# EAGLE design Endonasal_Module_Breakout_rev1 (EAGLE 9.0.1)
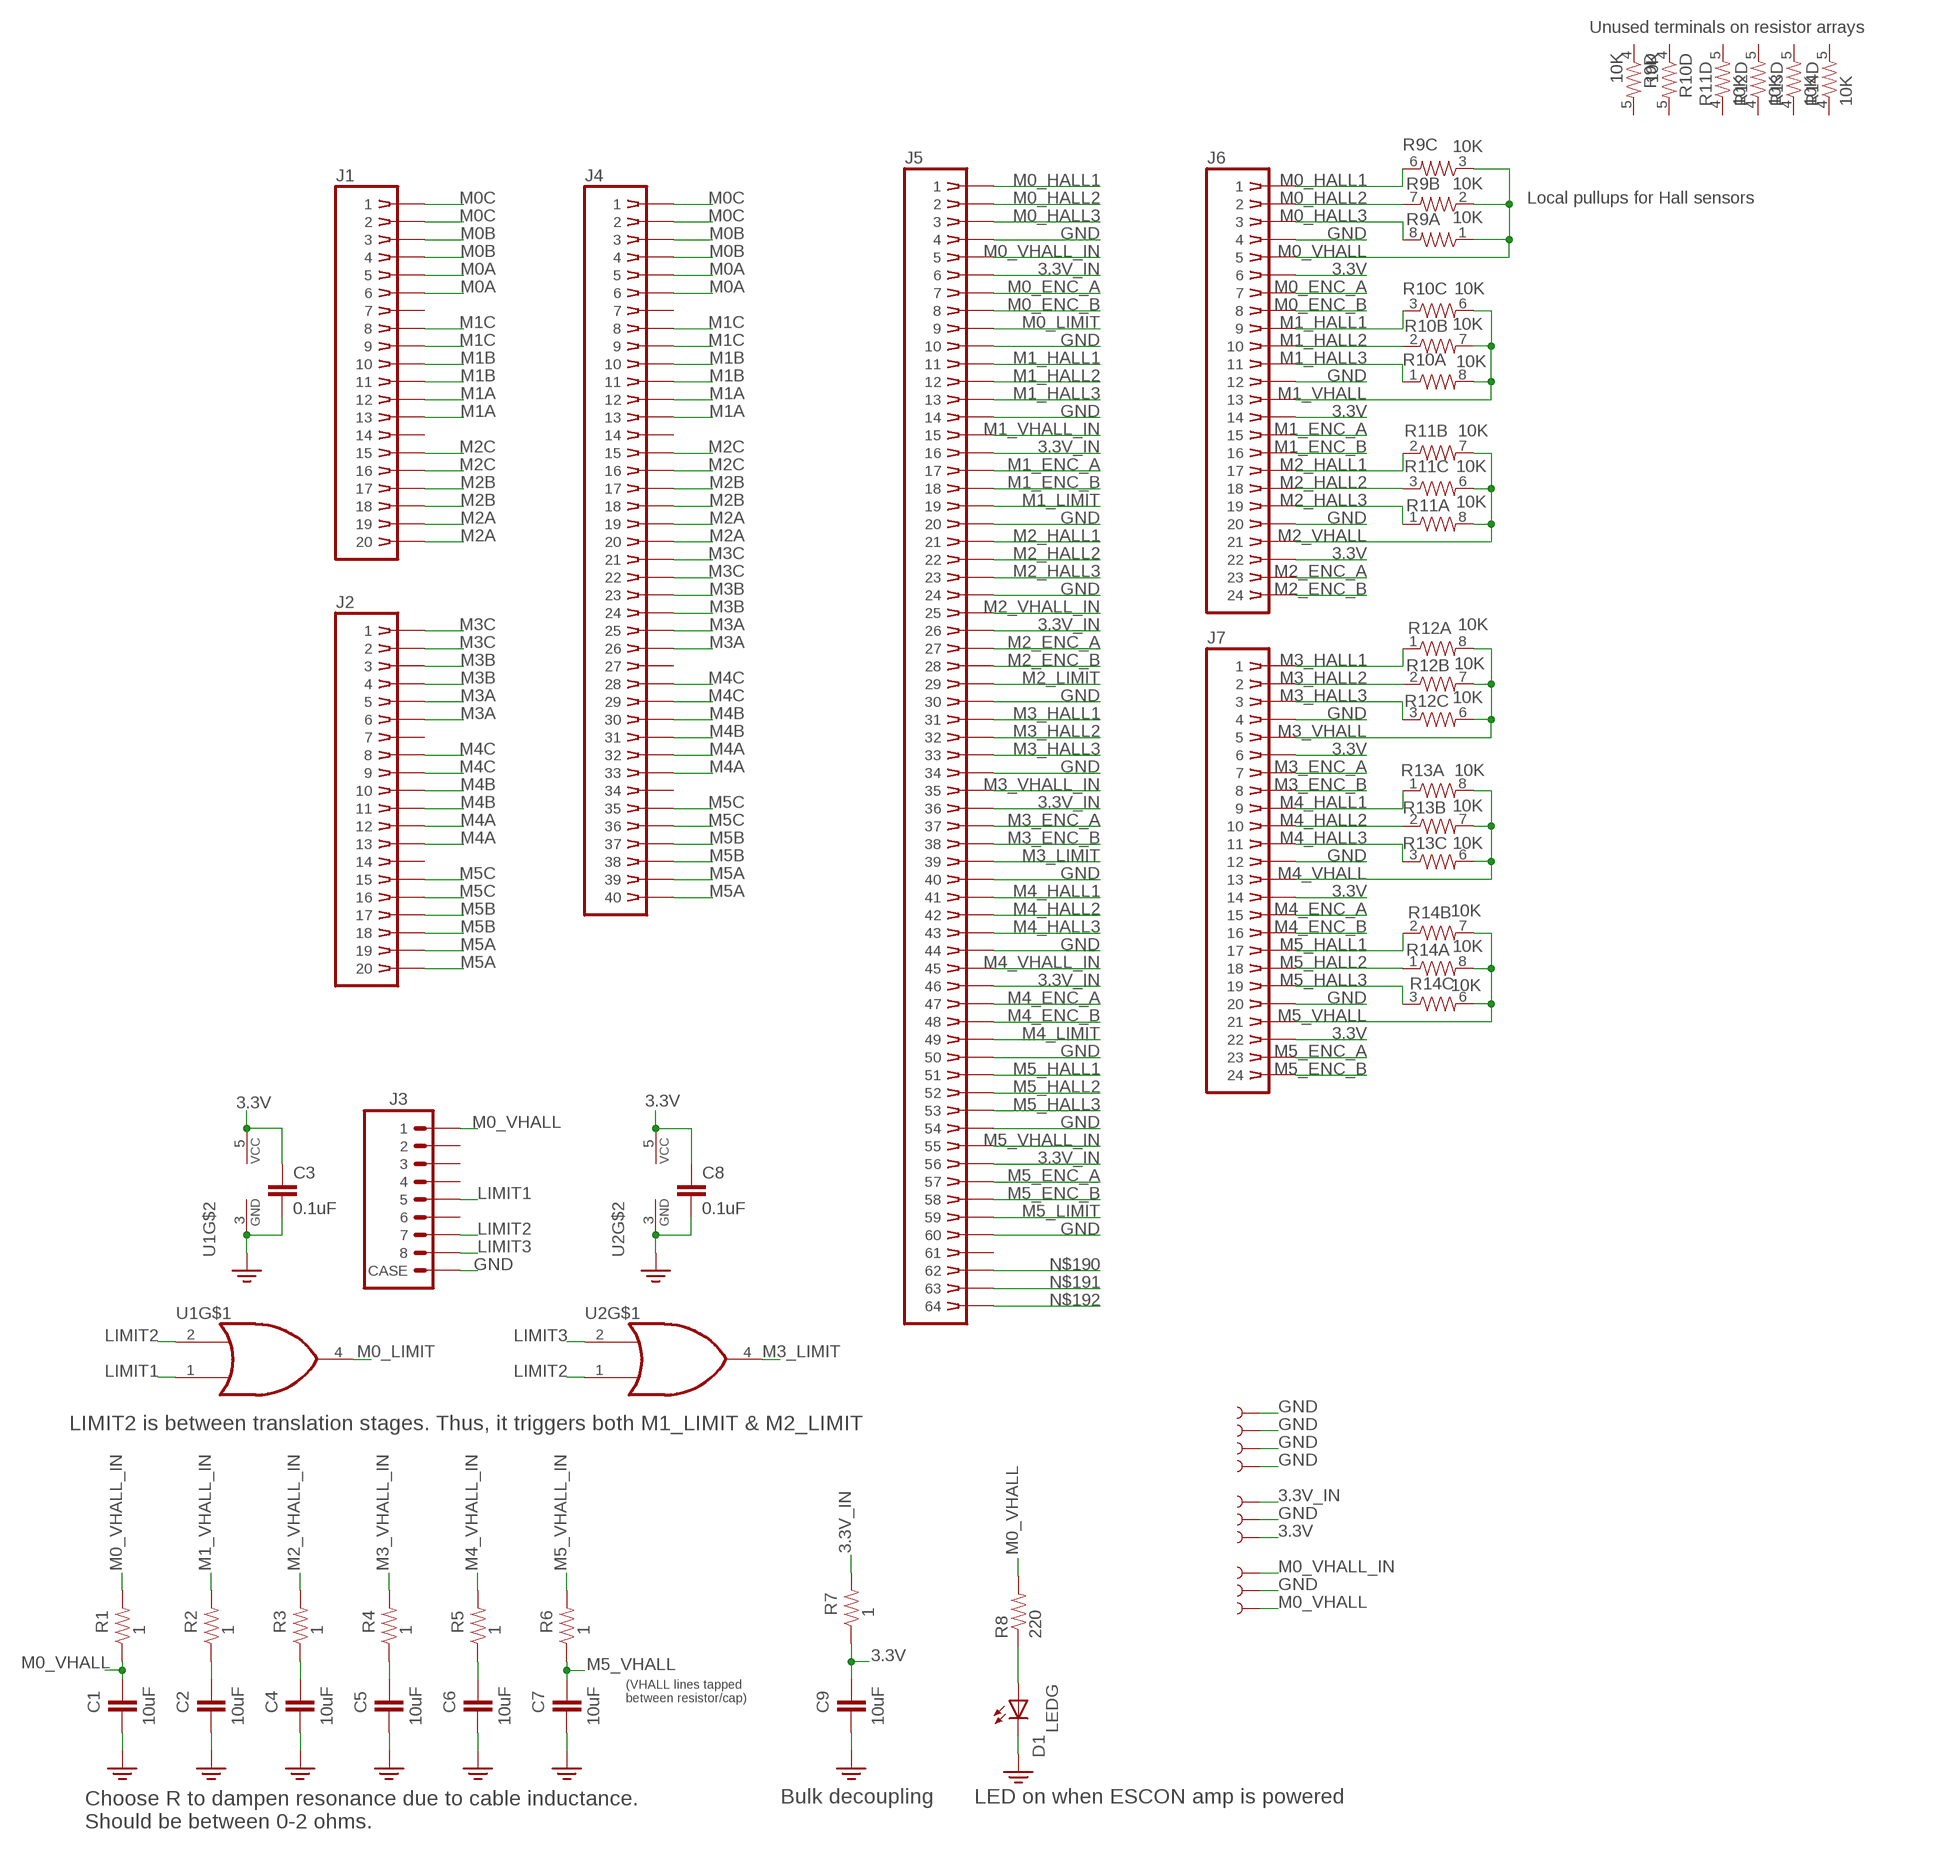
[diagram p0: schematic, sheet 1]

## Parts
3.3V  TEST-POINT_5021  [TEST-POINT_5021]
3.3V-IN  TEST-POINT_5021  [TEST-POINT_5021]
5V  TEST-POINT_5021  [TEST-POINT_5021]
5V-IN  TEST-POINT_5021  [TEST-POINT_5021]
C1  10uF  CAP0805  [C0805K]
C2  10uF  CAP0805  [C0805K]
C3  0.1uF  CAP0603-CAP  [0603-CAP]
C4  10uF  CAP0805  [C0805K]
C5  10uF  CAP0805  [C0805K]
C6  10uF  CAP0805  [C0805K]
C7  10uF  CAP0805  [C0805K]
C8  0.1uF  CAP0603-CAP  [0603-CAP]
C9  10uF  CAP0805  [C0805K]
D1  LEDG  LED-0805  [LED-0805]
GND  TEST-POINT_5021  [TEST-POINT_5021]
J1  CONN_RECT_2X10TH  [CONN_IDC_20_MALE_TH]
J2  CONN_RECT_2X10TH  [CONN_IDC_20_MALE_TH]
J3  JACK_8P8C_RJ45_ETHERNET  [ETHERNET_A104932]
J4  CONN_RECT_2X20TH  [CONN_IDC_40_MALE_TH]
J5  CONN_RECT_2X32NOHOLES  [CONN_IDC_64_MALE_TH_NOHOLES]
J6  CONN_RECT_2X12TH  [CONN_IDC_24_MALE_TH]
J7  CONN_RECT_2X12TH  [CONN_IDC_24_MALE_TH]
R1  1  RESISTOR-0603  [0603-RES]
R2  1  RESISTOR-0603  [0603-RES]
R3  1  RESISTOR-0603  [0603-RES]
R4  1  RESISTOR-0603  [0603-RES]
R5  1  RESISTOR-0603  [0603-RES]
R6  1  RESISTOR-0603  [0603-RES]
R7  1  RESISTOR-0603  [0603-RES]
R8  220  RESISTOR-0603  [0603-RES]
R9  10K  RESISTOR-ARRAY0603-ARV  [0603-ARV]
R10  10K  RESISTOR-ARRAY0603-ARV  [0603-ARV]
R11  10K  RESISTOR-ARRAY0603-ARV  [0603-ARV]
R12  10K  RESISTOR-ARRAY0603-ARV  [0603-ARV]
R13  10K  RESISTOR-ARRAY0603-ARV  [0603-ARV]
R14  10K  RESISTOR-ARRAY0603-ARV  [0603-ARV]
TP5  TEST-POINT_5021  [TEST-POINT_5021]
TP7  TEST-POINT3X5  [PAD.03X.05]
TP8  TEST-POINT3X5  [PAD.03X.05]
TP9  TEST-POINT3X5  [PAD.03X.05]
TP10  TEST-POINT3X5  [PAD.03X.05]
U1  OR_M0  OR  [SOT353]
U2  OR_M3  OR  [SOT353]

## Nets
3.3V [POWER]: 3.3V.P$1 C3.1 C8.1 C9.1 J6.P$6 J6.P$14 J6.P$22 J7.P$6 J7.P$14 J7.P$22 R7.1 U1.5(VCC) U2.5(VCC)
3.3V_IN [POWER]: 3.3V-IN.P$1 J5.P$6 J5.P$16 J5.P$26 J5.P$36 J5.P$46 J5.P$56 R7.2
GND [POWER]: C1.2 C2.2 C3.2 C4.2 C5.2 C6.2 C7.2 C8.2 C9.2 D1.C GND.P$1 J3.SHIELD1(CASE) J3.SHIELD2(CASE) J5.P$4 J5.P$10 J5.P$14 J5.P$20 J5.P$24 J5.P$30 J5.P$34 J5.P$40 J5.P$44 J5.P$50 J5.P$54 J5.P$60 J6.P$4 J6.P$12 J6.P$20 J7.P$4 J7.P$12 J7.P$20 TP5.P$1 TP7.P$1 TP8.P$1 TP9.P$1 TP10.P$1 U1.3(GND) U2.3(GND) ; supply symbol labelled GND2
LIMIT1: J3.P$5 U1.1(B)
LIMIT2: J3.P$7 U1.2(A) U2.1(B)
LIMIT3: J3.P$8 U2.2(A)
M0_ENC_A: J5.P$7 J6.P$7
M0_ENC_B: J5.P$8 J6.P$8
M0_HALL1: J5.P$1 J6.P$1 R9.6
M0_HALL2: J5.P$2 J6.P$2 R9.7
M0_HALL3: J5.P$3 J6.P$3 R9.8
M0_LIMIT: J5.P$9 U1.4(Y)
M0_VHALL [POWER]: 5V.P$1 C1.1 J3.P$1 J6.P$5 R1.1 R8.2 R9.1 R9.2 R9.3
M0_VHALL_IN [POWER]: 5V-IN.P$1 J5.P$5 R1.2
M0A [MOTOR]: J1.P$5 J1.P$6 J4.P$5 J4.P$6
M0B [MOTOR]: J1.P$3 J1.P$4 J4.P$3 J4.P$4
M0C [MOTOR]: J1.P$1 J1.P$2 J4.P$1 J4.P$2
M1_ENC_A: J5.P$17 J6.P$15
M1_ENC_B: J5.P$18 J6.P$16
M1_HALL1: J5.P$11 J6.P$9 R10.3
M1_HALL2: J5.P$12 J6.P$10 R10.2
M1_HALL3: J5.P$13 J6.P$11 R10.1
M1_LIMIT: J5.P$19
M1_VHALL [POWER]: C2.1 J6.P$13 R2.1 R10.6 R10.7 R10.8
M1_VHALL_IN [POWER]: J5.P$15 R2.2
M1A [MOTOR]: J1.P$12 J1.P$13 J4.P$12 J4.P$13
M1B [MOTOR]: J1.P$10 J1.P$11 J4.P$10 J4.P$11
M1C [MOTOR]: J1.P$8 J1.P$9 J4.P$8 J4.P$9
M2_ENC_A: J5.P$27 J6.P$23
M2_ENC_B: J5.P$28 J6.P$24
M2_HALL1: J5.P$21 J6.P$17 R11.2
M2_HALL2: J5.P$22 J6.P$18 R11.3
M2_HALL3: J5.P$23 J6.P$19 R11.1
M2_LIMIT: J5.P$29
M2_VHALL [POWER]: C4.1 J6.P$21 R3.1 R11.6 R11.7 R11.8
M2_VHALL_IN [POWER]: J5.P$25 R3.2
M2A [MOTOR]: J1.P$19 J1.P$20 J4.P$19 J4.P$20
M2B [MOTOR]: J1.P$17 J1.P$18 J4.P$17 J4.P$18
M2C [MOTOR]: J1.P$15 J1.P$16 J4.P$15 J4.P$16
M3_ENC_A: J5.P$37 J7.P$7
M3_ENC_B: J5.P$38 J7.P$8
M3_HALL1: J5.P$31 J7.P$1 R12.1
M3_HALL2: J5.P$32 J7.P$2 R12.2
M3_HALL3: J5.P$33 J7.P$3 R12.3
M3_LIMIT: J5.P$39 U2.4(Y)
M3_VHALL [POWER]: C5.1 J7.P$5 R4.1 R12.6 R12.7 R12.8
M3_VHALL_IN [POWER]: J5.P$35 R4.2
M3A [MOTOR]: J2.P$5 J2.P$6 J4.P$25 J4.P$26
M3B [MOTOR]: J2.P$3 J2.P$4 J4.P$23 J4.P$24
M3C [MOTOR]: J2.P$1 J2.P$2 J4.P$21 J4.P$22
M4_ENC_A: J5.P$47 J7.P$15
M4_ENC_B: J5.P$48 J7.P$16
M4_HALL1: J5.P$41 J7.P$9 R13.1
M4_HALL2: J5.P$42 J7.P$10 R13.2
M4_HALL3: J5.P$43 J7.P$11 R13.3
M4_LIMIT: J5.P$49
M4_VHALL [POWER]: C6.1 J7.P$13 R5.1 R13.6 R13.7 R13.8
M4_VHALL_IN [POWER]: J5.P$45 R5.2
M4A [MOTOR]: J2.P$12 J2.P$13 J4.P$32 J4.P$33
M4B [MOTOR]: J2.P$10 J2.P$11 J4.P$30 J4.P$31
M4C [MOTOR]: J2.P$8 J2.P$9 J4.P$28 J4.P$29
M5_ENC_A: J5.P$57 J7.P$23
M5_ENC_B: J5.P$58 J7.P$24
M5_HALL1: J5.P$51 J7.P$17 R14.2
M5_HALL2: J5.P$52 J7.P$18 R14.1
M5_HALL3: J5.P$53 J7.P$19 R14.3
M5_LIMIT: J5.P$59
M5_VHALL [POWER]: C7.1 J7.P$21 R6.1 R14.6 R14.7 R14.8
M5_VHALL_IN [POWER]: J5.P$55 R6.2
M5A [MOTOR]: J2.P$19 J2.P$20 J4.P$39 J4.P$40
M5B [MOTOR]: J2.P$17 J2.P$18 J4.P$37 J4.P$38
M5C [MOTOR]: J2.P$15 J2.P$16 J4.P$35 J4.P$36
N$6: D1.A R8.1
N$190: J5.P$62
N$191: J5.P$63
N$192: J5.P$64
Unconnected: J1.P$7 J1.P$14 J2.P$7 J2.P$14 J3.P$2 J3.P$3 J3.P$4 J3.P$6 J4.P$7 J4.P$14 J4.P$27 J4.P$34 J5.P$61 R9.4 R9.5 R10.4 R10.5 R11.4 R11.5 R12.4 R12.5 R13.4 R13.5 R14.4 R14.5

## Notes on the sheet
- Unused terminals on resistor arrays
- Local pullups for Hall sensors
- LIMIT2 is between translation stages. Thus, it triggers both M1_LIMIT & M2_LIMIT
- (VHALL lines tapped 
  between resistor/cap)
- Bulk decoupling | LED on when ESCON amp is powered
- Choose R to dampen resonance due to cable inductance.
  Should be between 0-2 ohms.

## Library data of the parts
3.3V 3.3V-IN 5V 5V-IN GND TP5 TP7-TP10 = Cannula_1_0:TEST-POINT: Bare copper test points for troubleshooting or ICT
C1 C2 C4-C7 C9 = Cannula_1_0:CAP0805
C3 C8 = SparkFun-Capacitors:CAP: Capacitor Standard 0603 ceramic capacitor, and 0.1" leaded capacitor.
D1 = Cannula_1_0:LED
J1 J2 = Cannula_1_0:CONN_RECT_2X10
J3 = Cannula_1_0:JACK_8P8C_RJ45_ETHERNET
J4 = Cannula_1_0:CONN_RECT_2X20
J5 = Cannula_1_0:CONN_RECT_2X32
J6 J7 = Cannula_1_0:CONN_RECT_2X12
R1-R8 = Cannula_1_0:RESISTOR
R9-R14 = SparkFun-Passives:RESISTOR-ARRAY: Array Chip Resistor Source: RS Component / Phycomp
U1 U2 = Cannula_1_0:OR

## Net classes
1 POWER: width 0.229 mm
2 MOTOR: width 0.483 mm

## Board
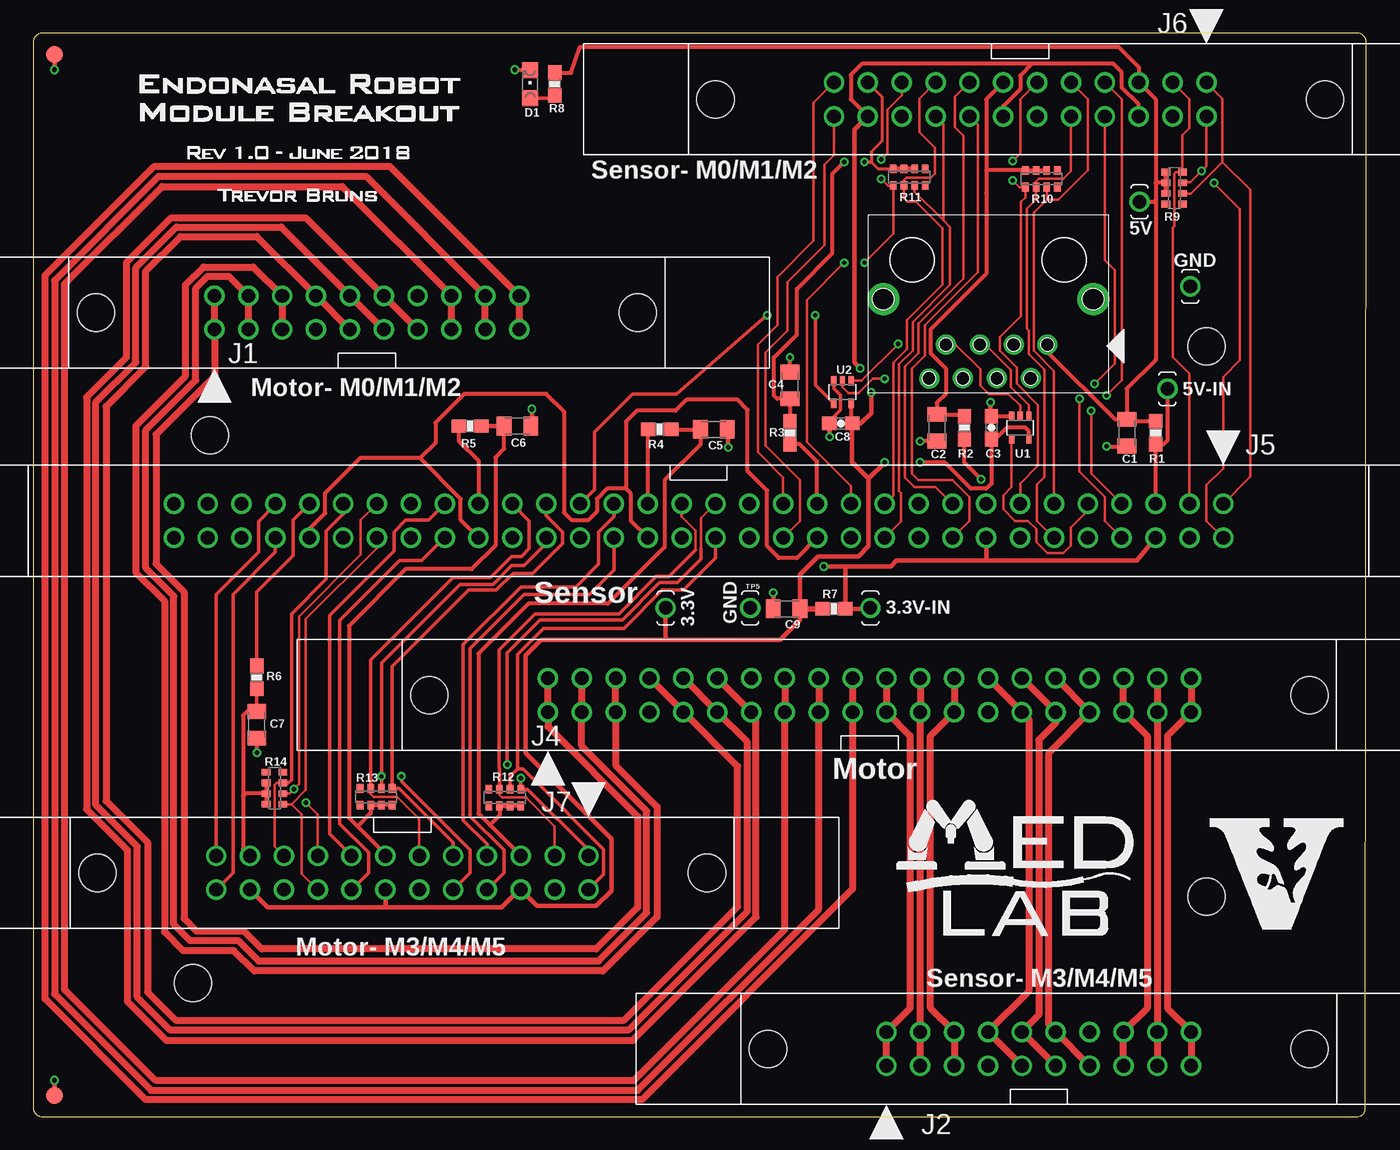
[diagram p1: board, top side]
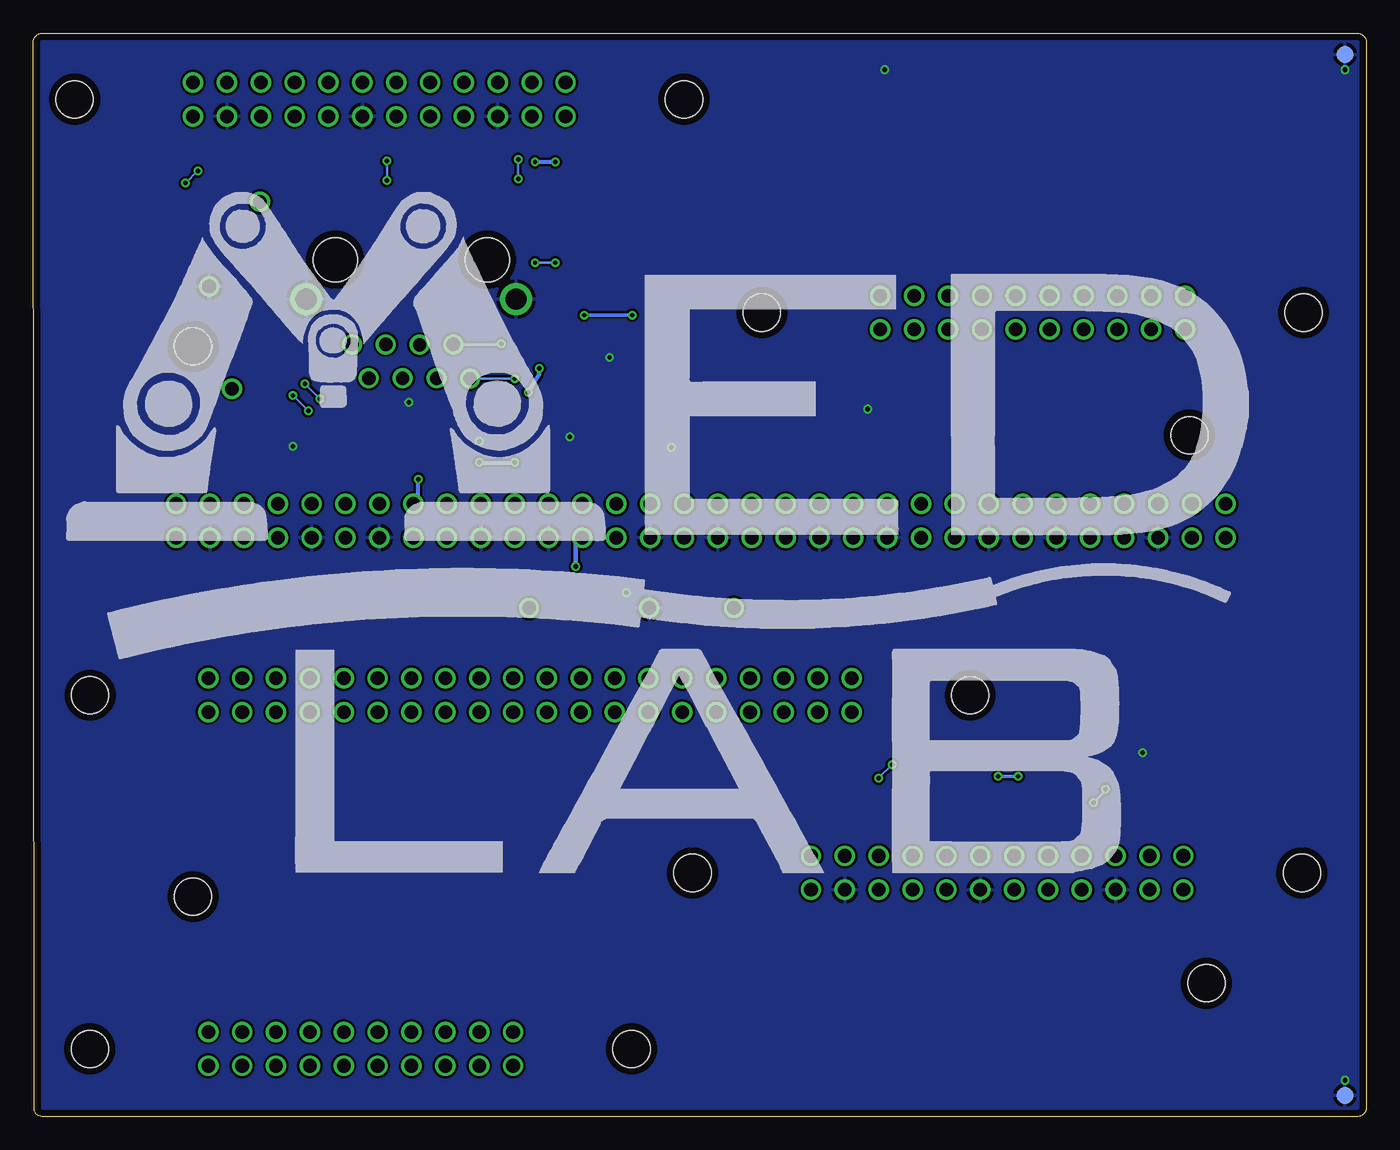
[diagram p2: board, bottom side, seen from below]

Size 100 x 81.28 mm. Coordinates in mm from the lower left corner, seen from the top.
Outline: 0,80.64 0,0.64 arc90 0.64,0 99.31,0 arc90 99.95,0.63 100,80.64 arc90 99.36,81.28 0.64,81.28 arc90 0,80.64
Copper layers (1*16): Top 0.035mm / dielectric 1.5mm / Bottom 0.035mm
Design rules "PCBWay *": minimum track width 7mil, minimum drill 12mil, track to track 7mil, track to pad 7mil, pad to pad 7mil, via to via 7mil, smd to smd 7mil, copper to edge 20mil, drill to drill 8mil, minimum pad ring 7mil, minimum via ring 6mil, stop-mask expansion 4mil, vias tented up to drill 0mil, thermal gap 10mil
Holes 2.79 mm at 13.26,51.13 88.01,57.78 88.01,16.51 11.99,10.01

### Footprints (pad centres in the part's own frame; a part is rotated, then mirrored left to right if it is on the bottom)
TEST-POINT_5021 = drill 1.016: P$1 0,0
C0805K = smd 1.1 x 1.4: 1 -1,0; 2 1,0
0603-CAP = smd 1.1 x 1: 1 -0.85,0; 2 0.85,0
LED-0805 = smd 1.2 x 1.2: A 0,-1.05; C 0,1.05
CONN_IDC_20_MALE_TH = drill 1.02: P$1 -11.43,-1.27; P$2 -11.43,1.27; P$3 -8.89,-1.27; P$4 -8.89,1.27; P$5 -6.35,-1.27; P$6 -6.35,1.27; P$7 -3.81,-1.27; P$8 -3.81,1.27; P$9 -1.27,-1.27; P$10 -1.27,1.27; P$11 1.27,-1.27; P$12 1.27,1.27; P$13 3.81,-1.27; P$14 3.81,1.27; P$15 6.35,-1.27; P$16 6.35,1.27; P$17 8.89,-1.27; P$18 8.89,1.27; P$19 11.43,-1.27; P$20 11.43,1.27 | hole 2.794: -20.32,0; 20.32,0
ETHERNET_A104932 = drill 1: P$1 -4.343,3.404; P$2 -3.073,5.944; P$3 -1.803,3.404; P$4 -0.533,5.944; P$5 0.737,3.429; P$6 2.007,5.944; P$7 3.277,3.404; P$8 4.521,5.969 | drill 1.6: SHIELD1 -7.772,0; SHIELD2 7.976,0 | hole 3.327: -5.588,-2.946; 5.817,-2.946
CONN_IDC_40_MALE_TH = drill 1.02: P$1 -24.13,-1.27; P$2 -24.13,1.27; P$3 -21.59,-1.27; P$4 -21.59,1.27; P$5 -19.05,-1.27; P$6 -19.05,1.27; P$7 -16.51,-1.27; P$8 -16.51,1.27; P$9 -13.97,-1.27; P$10 -13.97,1.27; P$11 -11.43,-1.27; P$12 -11.43,1.27; P$13 -8.89,-1.27; P$14 -8.89,1.27; P$15 -6.35,-1.27; P$16 -6.35,1.27; P$17 -3.81,-1.27; P$18 -3.81,1.27; P$19 -1.27,-1.27; P$20 -1.27,1.27; P$21 1.27,-1.27; P$22 1.27,1.27; P$23 3.81,-1.27; P$24 3.81,1.27; P$25 6.35,-1.27; P$26 6.35,1.27; P$27 8.89,-1.27; P$28 8.89,1.27; P$29 11.43,-1.27; P$30 11.43,1.27; P$31 13.97,-1.27; P$32 13.97,1.27; P$33 16.51,-1.27; P$34 16.51,1.27; P$35 19.05,-1.27; P$36 19.05,1.27; P$37 21.59,-1.27; P$38 21.59,1.27; P$39 24.13,-1.27; P$40 24.13,1.27 | hole 2.794: -33.02,0; 33,0
CONN_IDC_64_MALE_TH_NOHOLES = drill 1.02: P$1 -39.37,-1.27; P$2 -39.37,1.27; P$3 -36.83,-1.27; P$4 -36.83,1.27; P$5 -34.29,-1.27; P$6 -34.29,1.27; P$7 -31.75,-1.27; P$8 -31.75,1.27; P$9 -29.21,-1.27; P$10 -29.21,1.27; P$11 -26.67,-1.27; P$12 -26.67,1.27; P$13 -24.13,-1.27; P$14 -24.13,1.27; P$15 -21.59,-1.27; P$16 -21.59,1.27; P$17 -19.05,-1.27; P$18 -19.05,1.27; P$19 -16.51,-1.27; P$20 -16.51,1.27; P$21 -13.97,-1.27; P$22 -13.97,1.27; P$23 -11.43,-1.27; P$24 -11.43,1.27; P$25 -8.89,-1.27; P$26 -8.89,1.27; P$27 -6.35,-1.27; P$28 -6.35,1.27; P$29 -3.81,-1.27; P$30 -3.81,1.27; P$31 -1.27,-1.27; P$32 -1.27,1.27; P$33 1.27,-1.27; P$34 1.27,1.27; P$35 3.81,-1.27; P$36 3.81,1.27; P$37 6.35,-1.27; P$38 6.35,1.27; P$39 8.89,-1.27; P$40 8.89,1.27; P$41 11.43,-1.27; P$42 11.43,1.27; P$43 13.97,-1.27; P$44 13.97,1.27; P$45 16.51,-1.27; P$46 16.51,1.27; P$47 19.05,-1.27; P$48 19.05,1.27; P$49 21.59,-1.27; P$50 21.59,1.27; P$51 24.13,-1.27; P$52 24.13,1.27; P$53 26.67,-1.27; P$54 26.67,1.27; P$55 29.21,-1.27; P$56 29.21,1.27; P$57 31.75,-1.27; P$58 31.75,1.27; P$59 34.29,-1.27; P$60 34.29,1.27; P$61 36.83,-1.27; P$62 36.83,1.27; P$63 39.37,-1.27; P$64 39.37,1.27
CONN_IDC_24_MALE_TH = drill 1.02: P$1 -13.97,-1.27; P$2 -13.97,1.27; P$3 -11.43,-1.27; P$4 -11.43,1.27; P$5 -8.89,-1.27; P$6 -8.89,1.27; P$7 -6.35,-1.27; P$8 -6.35,1.27; P$9 -3.81,-1.27; P$10 -3.81,1.27; P$11 -1.27,-1.27; P$12 -1.27,1.27; P$13 1.27,-1.27; P$14 1.27,1.27; P$15 3.81,-1.27; P$16 3.81,1.27; P$17 6.35,-1.27; P$18 6.35,1.27; P$19 8.89,-1.27; P$20 8.89,1.27; P$21 11.43,-1.27; P$22 11.43,1.27; P$23 13.97,-1.27; P$24 13.97,1.27 | hole 2.794: -22.86,0; 22.86,0
0603-RES = smd 1.1 x 1: 1 -0.85,0; 2 0.85,0
0603-ARV = smd 0.5 x 0.65: 1 -1.2,-0.625; 2 -0.4,-0.625; 3 0.4,-0.625; 4 1.2,-0.625; 5 1.2,0.625; 6 0.4,0.625; 7 -0.4,0.625; 8 -1.2,0.625
PAD.03X.05 = smd 1.27 x 1.27: P$1 0,0
SOT353 = smd 0.4 x 0.7: 1 -0.65,-0.85; 2 0,-0.85; 3 0.65,-0.85; 4 0.65,0.85; 5 -0.65,0.85

### Placement (x,y rotation side)
3.3V  47.43,38.16 270 top
3.3V-IN  62.8,38.16 270 top
5V  82.99,68.64 270 top
5V-IN  85.09,54.61 270 top
C1  82.04,51.31 270 top
C2  67.79,51.69 270 top
C3  71.88,51.69 90 top
C4  56.77,54.86 90 top
C5  51.05,51.56 0 top
C6  36.32,51.82 0 top
C7  16.76,29.4 270 top
C8  60.58,52.01 180 top
C9  56.52,38.1 180 top
D1  37.27,77.47 0 top
GND  86.8,62.29 270 top
J1  25.02,60.33 0 top
J2  75.44,5.08 0 top
J3  71.75,61.34 180 top
J4  62.74,31.62 0 top
J5  49.91,44.7 180 top
J6  74.04,76.33 180 top
J7  27.69,18.29 180 top
R1  84.2,51.31 270 top
R2  69.85,51.69 270 top
R3  56.77,51.31 270 top
R4  46.99,51.56 180 top
R5  32.77,51.82 180 top
R6  16.76,32.96 90 top
R7  60.07,38.1 0 top
R8  39.12,77.47 90 top
R9  85.6,69.66 270 top
R10  75.63,70.36 0 top
R11  65.72,70.48 0 top
R12  35.37,23.94 180 top
R13  25.72,24 180 top
R14  18.1,24.64 90 top
TP5  53.78,38.16 270 top
TP7  1.59,79.69 90 bottom
TP8  1.59,79.69 270 top
TP9  1.59,1.59 90 bottom
TP10  1.59,1.59 270 top
U1  74.04,51.69 180 top
U2  60.71,54.36 180 top
U$1  [LOGO_MEDLAB_3X2]  53.47,43.88 0 bottom
U$2  [LOGO_V_OAK]  93.73,18.92 0 top
U$4  [LOGO_MEDLAB_0.7X0.4]  74.1,18.03 0 top
U$5  [LOGO_ENDONASAL_BREAKOUT_1.0]  19.81,73.53 0 top

### Tracks (layer width: path | path; a pad name or v marks a point on that pad's centre or on a via)
3.3V  (via drill 0.33)
  Top 0.305: J6.P$6 82.93,75.95 81.66,77.22 81.66,78.36 81.03,78.99 74.93,78.99 | J6.P$14 72.77,75.82 74.04,77.09 74.04,78.11 74.93,78.99 | U1.5 74.69,51.42 74.42,51.69 73.03,51.69 72.17,50.84 C3.1 71.88,47.5 71.5,47.12 70.36,47.12 68.39,49.09 v66.55,49.09 | U2.5 61.36,52.08 C8.1 | J6.P$22 61.34,76.33 61.34,78.17 62.17,78.99 74.93,78.99
  Top 0.356: J6.P$22 61.59,74.04 61.59,56.58 v62.04,56.13 | 62.67,47.88 v63.88,49.09 | v62.87,54.36 62.87,52.77 62.04,52.01 C8.1 61.43,49.12 62.67,47.88 | 47.62,35.75 38.08,35.75 36.92,34.58 36.92,27.28 43.37,20.83 43.37,16.95 42.23,15.81 37.78,15.81 J7.P$6 36.45,17.02 35.12,15.68 26.29,15.68 | 47.62,35.75 56.01,35.75 57.52,37.26 C9.1 57.52,40.69 58.86,42.04 61.91,42.04 62.67,42.8 62.67,47.88 | J7.P$22 17.59,15.68 26.29,15.68 | J7.P$14 26.42,15.81 26.29,15.68 | 3.3V.P$1 47.43,35.94 47.62,35.75
  Top 0.406: C9.1 R7.1
  Bottom 0.305: v66.55,49.09 v63.88,49.09
  Bottom 0.356: v62.04,56.13 62.04,55.69 v62.87,54.36
3.3V_IN  (via drill 0.36)
  Top 0.305: J5.P$56 20.7,44.07 21.91,45.28 21.91,46.8 24.51,49.4 29.02,49.4 | J5.P$46 32.07,44.77 32.07,46.35 29.02,49.4 | J5.P$36 44.83,44.7 44.83,46.74 44.45,47.12 | 44.45,47.12 43.05,47.12 42.29,46.35 42.29,45.4 41.66,44.77 40.39,44.77 39.81,45.34 39.81,52.9 38.48,54.23 32.32,54.23 30.16,52.07 30.16,50.55 29.02,49.4 | J5.P$26 57.28,41.91 55.94,41.91 55.05,42.8 55.05,46.99 53.59,48.45 53.59,53.02 52.83,53.78 49.02,53.78 48.2,52.96 45.28,52.96 44.45,52.13 44.45,47.12
  Top 0.356: 71.5,41.72 82.8,41.72 J5.P$6 | J5.P$16 71.5,41.72 | 71.5,41.72 64.77,41.72 64.33,41.27 60.96,41.27 | 60.96,41.27 v59.31,41.27 | 60.96,41.27 60.92,41.24 R7.2 62.74,38.1 3.3V-IN.P$1
  Bottom 0.356: v59.31,41.27 59.31,42.93 J5.P$26
GND  (via drill 0.33, 0.35, 0.36)
  Top 0.254: U2.3 60.06,54.62 60.56,54.12 60.56,53.03 59.73,52.2 C8.2
  Top 0.305: v80.52,50.29 82.03,50.29 C1.2 | U1.3 C3.2 | C2.2 66.56,50.69 v66.55,50.67 | C4.2 v56.77,56.96 | C7.2 v16.76,27.3 | v36.13,78.55 37.24,78.55 D1.C
  Top 0.356: v71.82,53.59 71.82,52.6 C3.2 | C8.2 59.73,51.02 v59.75,50.99 | v52.13,50.23 52.13,51.64 C5.2 | v55.5,39.31 55.52,39 C9.2 | v37.4,53.09 37.4,51.9 C6.2 | TP9.P$1 v1.59,2.73 | TP7.P$1 v1.59,78.55
  pour Bottom: -1.27,84.07 101.6,84.07 101.6,-2.29 -1.27,-2.29
LIMIT1
  Top 0.203: J3.P$5 71.44,57.91 73.34,56.01 73.34,54.74 74.69,53.39 U1.1
LIMIT2  (via drill 0.33)
  Top 0.203: J3.P$7 69.19,57.94 71.06,56.07 71.06,54.86 71.69,54.23 73.15,54.23 74.04,53.34 U1.2 | v64.9,57.98 62.13,55.21 U2.1
  Bottom 0.203: J3.P$7 64.94,57.94 v64.9,57.98
LIMIT3  (via drill 0.33)
  Top 0.203: v63.88,55.37 62.99,55.37 61.91,54.29 61.15,54.29 60.71,54.74 U2.2
  Bottom 0.203: J3.P$8 v63.88,55.37
M0_ENC_A  (via drill 0.33)
  Top 0.203: J5.P$7 79.38,48.26 v79.38,52.96 | v80.52,54.1 81.66,55.24 81.66,76.33 J6.P$7
  Bottom 0.203: v79.38,52.96 v80.52,54.1
M0_ENC_B  (via drill 0.33)
  Top 0.203: J6.P$8 80.39,64.26 81.15,63.5 81.15,56.52 v79.63,54.99 | v78.49,53.85 78.49,48.39 80.39,46.48 80.39,44.7 J5.P$8
  Bottom 0.203: v79.63,54.99 v78.49,53.85
M0_HALL1
  Top 0.203: J5.P$1 91.31,48.01 91.31,69.53 89.22,71.63 | J6.P$1 89.22,76.39 89.22,71.63 | R9.6 86.85,69.26 89.22,71.63
M0_HALL2  (via drill 0.33)
  Top 0.203: J5.P$2 88.01,44.7 88.01,47.37 89.28,48.64 89.28,55.5 90.53,56.74 90.53,68.1 v88.58,70.04 | J6.P$2 88.01,71.31 v87.66,70.96 86.81,70.1 86.27,70.1 R9.7
  Bottom 0.203: v88.58,70.04 v87.66,70.96
M0_HALL3
  Top 0.203: J6.P$3 86.74,76.33 86.74,74.17 86.22,73.65 R9.8 85.72,70.86 85.6,70.74 85.6,66.8 85.5,66.7 85.5,57 86.74,55.75 J5.P$3
M0_LIMIT
  Top 0.203: J5.P$9 79.12,45.47 77.85,44.2 77.85,42.86 77.28,42.29 76.07,42.29 75.25,43.12 75.25,44.07 74.61,44.7 73.66,44.7 72.77,45.59 72.77,46.61 73.39,47.23 U1.4
M0_VHALL
  Top 0.305: R1.1 82.19,52.16 C1.1 | C1.1 82.04,54.61 84.2,56.77 84.2,68.77 | 84.2,70.04 84.2,76.33 J6.P$5 82.93,78.74 81.41,80.26 41.02,80.26 40.35,78.32 R8.2 | 84.2,70.04 84.2,68.77 | C1.1 81.17,52.31 76.1,57.38 J3.P$1 | R9.3 R9.2 | R9.2 R9.1 | R9.2 84.22,70.06 84.2,70.04 | 5V.P$1 84.07,68.64 84.2,68.77
M0_VHALL_IN
  Top 0.305: J5.P$5 R1.2 84.81,50.46 85.09,50.74 5V-IN.P$1
M0A
  Top 0.508: J4.P$6 J4.P$5 43.69,26.35 46.8,23.24 46.8,14.99 42.74,10.92 16.57,10.92 15.05,12.45 11.24,12.45 9.84,13.84 9.84,38.67 7.68,40.83 7.68,51.82 11.43,55.56 11.43,62.42 12.76,63.75 16.51,63.75 J1.P$6 | J1.P$6 J1.P$5 | J1.P$6 18.67,60.83
M0B
  Top 0.508: J4.P$4 J4.P$3 41.15,27.81 46.02,22.94 46.02,15.29 42.42,11.68 16.89,11.68 15.37,13.21 11.75,13.21 10.54,14.41 10.54,39.05 8.45,41.15 8.45,51.5 12.19,55.24 12.19,62.17 13.08,63.06 14.67,63.06 J1.P$4 | J1.P$4 J1.P$3 | J1.P$4 16.13,59.82
M0C
  Top 0.508: J4.P$2 J4.P$1 38.61,29.27 45.34,22.54 45.34,15.68 42.23,12.57 17.14,12.57 15.81,13.91 12.26,13.91 11.3,14.86 11.3,39.37 9.21,41.47 9.21,51.18 13.59,55.56 J1.P$1 J1.P$2
M1_ENC_A
  Top 0.203: J5.P$17 67.69,47.24 66.1,47.24 65.41,47.94 65.41,56.26 66.42,57.28 66.42,59.5 69.79,62.87 69.79,73.6 69.15,74.23 69.15,76.52 J6.P$15
M1_ENC_B
  Top 0.203: J6.P$16 70.87,74.42 70.87,63.37 66.88,59.38 66.88,57.1 65.91,56.13 65.91,48.26 66.42,47.75 68.96,47.75 70.23,46.48 70.23,44.7 J5.P$18
M1_HALL1
  Top 0.203: J6.P$9 79.12,76.33 79.12,70.99 76.92,68.79 76.03,68.79 | 76.03,68.79 R10.3 | 76.03,68.79 75.06,67.82 75.06,57.47 76.58,55.94 J5.P$11
M1_HALL2
  Top 0.203: J6.P$10 77.85,70.93 77.28,70.36 75.44,70.36 75.23,70.15 R10.2 75.23,68.81 74.55,68.14 74.55,59.12 74.68,58.99 74.68,57.21 75.86,56.03 75.86,47.98 75.31,47.43 75.31,44.7 J5.P$12
M1_HALL3  (via drill 0.33)
  Top 0.203: J6.P$11 74.04,76.33 74.04,72.26 v73.47,71.69 | v73.47,70.23 73.97,69.73 R10.1 74.42,68.96 74.11,68.64 74.11,60.07 72.52,58.48 72.52,57.47 73.79,56.2 73.79,54.98 75.37,53.4 75.37,48.83 74.04,47.5 J5.P$13
  Bottom 0.203: v73.47,71.69 v73.47,70.23
M1_VHALL
  Top 0.305: R2.1 69.7,52.69 C2.1 67.79,53.57 68.45,54.23 68.45,56.13 67.31,57.28 67.31,59.05 71.5,63.25 71.5,69.28 | J6.P$13 71.5,76.33 71.5,70.99 | 71.5,70.99 71.5,69.28 | 71.52,69.26 71.5,69.28 | 71.51,70.98 71.5,70.99 | R10.6 R10.7 R10.8 74.42,70.99 71.5,70.99
M1_VHALL_IN  (via drill 0.33)
  Top 0.305: v71.12,47.82 69.85,49.09 R2.2
  Bottom 0.305: J5.P$15 71.12,46.35 v71.12,47.82
M1A
  Top 0.508: J4.P$12 J4.P$13 54.23,29.97 54.23,14.99 44.96,5.71 9.97,5.71 7.05,8.64 7.05,20 4,23.05 4,53.98 6.99,56.96 6.99,64.07 10.35,67.44 20.45,67.44 J1.P$12 J1.P$13
M1B
  Top 0.508: J4.P$10 J4.P$11 53.53,28.13 53.53,15.37 44.64,6.48 10.29,6.48 7.81,8.95 7.81,20.26 4.7,23.37 4.7,53.59 7.68,56.58 7.68,63.69 10.73,66.74 18.61,66.74 J1.P$10 J1.P$11
M1C
  Top 0.508: J4.P$8 J4.P$9 52.83,26.29 52.83,15.75 44.32,7.24 10.67,7.24 8.57,9.34 8.57,20.57 5.46,23.69 5.46,53.28 8.45,56.26 8.45,63.44 11.05,66.04 16.76,66.04 J1.P$8 J1.P$9
M2_ENC_A
  Top 0.203: J5.P$27 56.26,47.94 54.36,49.85 54.36,57.91 55.82,59.37 55.82,62.99 58.55,65.72 58.55,76.07 J6.P$23
M2_ENC_B
  Top 0.203: J6.P$24 60.07,72.14 59.37,71.44 59.37,65.41 56.58,62.61 56.58,58.99 54.93,57.34 54.93,50.35 57.53,47.75 57.53,44.7 J5.P$28
M2_HALL1
  Top 0.203: J5.P$21 64.52,46.61 64.52,56.58 65.53,57.59 65.53,59.75 68.21,62.43 68.21,66.66 66.23,68.64 65.6,68.64 65.32,68.92 R11.2 65.32,70.28 65.51,70.46 67.35,70.46 67.63,70.74 67.63,72.71 66.48,73.85 66.48,76.39 J6.P$17
M2_HALL2
  Top 0.203: J5.P$22 65.09,44.64 65.09,46.8 64.96,46.93 64.96,56.45 65.98,57.47 65.98,59.63 68.77,62.42 68.77,66.74 68.26,67.25 | J6.P$18 68.26,74.49 68.26,67.25 | R11.3 66.12,69.39 68.26,67.25
M2_HALL3  (via drill 0.33)
  Top 0.203: v63.63,70.36 64.12,69.86 R11.1 64.52,66.24 v62.36,64.07 | J6.P$19 65.15,76.64 64.07,75.56 64.07,72.26 v63.63,71.82 | v60.83,64.07 58.04,61.28 58.04,50.61 61.34,47.31 J5.P$23
  Bottom 0.203: v63.63,71.82 v63.63,70.36 | v60.83,64.07 v62.36,64.07
M2_VHALL  (via drill 0.33)
  Top 0.229: J6.P$21 63.67,76.54 63.67,73.19 62.87,72.39 62.87,71.63 63.38,71.11 R11.8
  Top 0.254: 62.87,71.63 v62.36,71.63
  Top 0.305: R3.1 C4.1 55.8,53.86 55.56,54.1 55.56,56.96 57.28,58.67 57.28,62.1 59.94,64.77 59.94,70.74 v60.83,71.63 | R11.6 R11.7 R11.8
  Bottom 0.305: v60.83,71.63 v62.36,71.63
M2_VHALL_IN
  Top 0.305: J5.P$25 58.8,49.15 57.49,50.46 R3.2
M2A
  Top 0.508: J4.P$20 J4.P$19 61.47,17.08 45.66,1.27 8.45,1.27 0.89,8.83 0.89,63.12 9.08,71.31 26.73,71.31 J1.P$20 J1.P$19
M2B
  Top 0.508: J4.P$18 J4.P$17 58.93,15.56 45.34,1.97 8.83,1.97 1.59,9.21 1.59,62.74 9.4,70.55 24.96,70.55 J1.P$18 J1.P$17
M2C
  Top 0.508: J4.P$16 J4.P$15 56.39,14.03 45.09,2.73 9.14,2.73 2.35,9.53 2.35,62.48 9.65,69.79 23.18,69.79 J1.P$16 J1.P$15
M3_ENC_A
  Top 0.254: J7.P$7 34.04,20.45 32.26,22.23 32.26,35.43 36.58,39.75 40.7,39.75 42.42,41.47 42.42,43.88 43.56,45.02 J5.P$37
M3_ENC_B
  Top 0.254: J7.P$8 35.31,18.29 35.31,20 32.77,22.54 32.77,35.12 36.83,39.18 41.72,39.18 43.56,41.02 J5.P$38
M3_HALL1  (via drill 0.33)
  Top 0.203: J5.P$31 50.1,44.9 50.1,42.61
  Top 0.254: v36.58,25.4 v36.57,25.39 R12.1 37.09,24.56 41.66,20 J7.P$1 | v35.56,26.42 35.56,34.8 38.04,37.27 44.2,37.27 46.99,40.07 48.32,40.07 50.1,41.85 50.1,42.61
  Bottom 0.203: v36.58,25.4 v35.56,26.42
M3_HALL2
  Top 0.254: R12.2 35.77,25.55 36.32,26.1 | J5.P$32 51.18,41.91 48.77,39.5 47.18,39.5 44.32,36.64 38.29,36.64 36.32,34.67 36.32,26.1 | J7.P$2 42.8,18.16 42.8,20.07 37.47,25.4 37.47,25.39 36.76,26.1 36.32,26.1
M3_HALL3
  Top 0.203: R12.3 34.97,24.15 35.18,23.94 36.96,23.94 39.12,21.78 J7.P$3 | J5.P$33 48.64,45.02 49.69,43.98 49.69,42.51 49.31,42.13
  Top 0.254: R12.3 34.97,26.13 34.94,26.16 34.94,35 37.66,37.72 43.94,37.72 46.74,40.51 47.69,40.51 49.31,42.13 49.67,42.49
M3_LIMIT  (via drill 0.33)
  Top 0.254: J5.P$39 42.1,47.05 42.1,51.37 44.96,54.23 48.26,54.23 v55.05,60.13 | v58.67,60.13 58.67,54.89 U2.4
  Bottom 0.254: v55.05,60.13 v58.67,60.13
M3_VHALL
  Top 0.254: R12.8
  Top 0.305: R4.1 C5.1 50.05,50.44 47.37,47.75 47.37,42.74 43.12,38.48 37.15,38.48 33.4,34.73 33.4,22.73 34.26,21.88 | R12.8 R12.7 R12.6 34.97,22.59 34.26,21.88 | 34.26,21.88 J7.P$5
M3_VHALL_IN
  Top 0.305: J5.P$35 46.1,51.52 R4.2
M3A
  Top 0.508: J4.P$26 J4.P$25 67.31,28.57 67.31,8.13 J2.P$6 J2.P$5
M3B
  Top 0.508: J2.P$3 J2.P$4 J4.P$23 J4.P$24
M3C
  Top 0.508: J4.P$22 J4.P$21 65.79,28.57 65.79,8.13 J2.P$2 J2.P$1
M4_ENC_A
  Top 0.254: J5.P$47 29.65,44.77 27.94,44.77 27.05,43.88 27.05,42.42 22.23,37.59 22.23,21.21 J7.P$15
M4_ENC_B
  Top 0.254: J5.P$48 29.15,41.72 27.5,41.72 22.99,37.21 22.99,21.97 25.15,19.81 25.15,18.29 J7.P$16
M4_HALL1
  Top 0.254: J7.P$9 31.5,20.57 27.43,24.64 R13.1 | R13.1 | R13.1 26.93,33.78 32.64,39.5 34.73,39.5 36.01,40.77 37.47,40.77 39.69,42.99 39.69,43.88 38.48,45.09 J5.P$41
M4_HALL2  (via drill 0.33)
  Top 0.254: J7.P$10 32.77,18.29 32.77,20 27.62,25.15 v27.62,25.53 | R13.2 v26.12,25.53 26.12,34.05 32,39.94 34.48,39.94 35.88,41.34 36.83,41.34 38.48,42.99 J5.P$42
  Bottom 0.254: v27.62,25.53 v26.12,25.53
M4_HALL3
  Top 0.203: R13.3 25.32,24.21 25.53,24 27.3,24 28.96,22.35 J7.P$11
  Top 0.254: R13.3 25.32,34.27 31.5,40.45 34.29,40.45 35.88,42.04 36.64,42.04 37.21,42.61 37.21,44.7 J5.P$43
M4_VHALL
  Top 0.305: J7.P$13 26.42,19.68 24.32,21.78 | 24.32,21.78 23.69,22.42 23.69,36.83 27.94,41.08 32.89,41.08 34.67,42.86 34.67,49.47 35.32,50.12 C6.1 | R13.8 R13.7 R13.6 25.32,22.78 24.32,21.78
  Top 0.356: C6.1 R5.1
M4_VHALL_IN
  Top 0.305: R5.2 31.92,50.7 33.4,49.21 J5.P$45
M4A
  Top 0.508: J4.P$32 J4.P$33 76.2,27.3 76.2,6.86 J2.P$12 J2.P$13
M4B
  Top 0.508: J4.P$30 J4.P$31 76.71,29.53 75.44,28.26 75.44,7.62 J2.P$10 J2.P$11
M4C
  Top 0.508: J4.P$28 J4.P$29 74.68,29.84 74.68,9.4 J2.P$8 J2.P$9
M5_ENC_A
  Top 0.254: J7.P$23 13.72,39.18 16.89,42.35 16.89,44.64 18.16,45.91 J5.P$57
M5_ENC_B
  Top 0.254: J5.P$58 18.16,42.35 14.99,39.18 14.99,18.29 J7.P$24
M5_HALL1  (via drill 0.33)
  Top 0.203: J5.P$51 24.57,44.77 24.57,42.16 19.94,37.53 19.94,24.96 v19.56,24.57 19.22,24.24 R14.2 | J7.P$17 21.34,22.67 v20.45,23.56
  Bottom 0.203: v20.45,23.56 19.56,24.45 v19.56,24.57
M5_HALL2
  Top 0.203: J5.P$52 25.78,42.67 20.45,37.34 20.45,24.51 19.37,23.44 | 19.37,23.44 R14.1 | J7.P$18 20.13,18.22 20.13,22.68 19.37,23.44
M5_HALL3
  Top 0.203: J7.P$19 18.1,20.26 18.1,24.89 18.24,25.04 R14.3
  Top 0.254: R14.3 19.13,25.04 19.37,25.27 19.37,37.72 21.97,40.32 21.97,43.94 23.24,45.21 J5.P$53
M5_VHALL
  Top 0.254: R6.1 C7.1
  Top 0.305: C7.1 16.05,30.4 15.73,30.09 15.73,24.07 | 15.73,24.07 15.73,20.08 J7.P$21 | R14.6 R14.7 | R14.7 R14.8 | R14.7 15.9,24.24 15.73,24.07
M5_VHALL_IN
  Top 0.254: J5.P$55 19.49,44.77 19.49,42.1 16.76,39.37 R6.2
M5A
  Top 0.508: J2.P$19 J2.P$20 85.09,8.13 85.09,28.57 J4.P$39 J4.P$40
M5B
  Top 0.508: J4.P$38 J4.P$37 J2.P$18 J2.P$17
M5C
  Top 0.508: J2.P$15 J2.P$16 83.57,8.13 83.57,28.57 J4.P$35 J4.P$36
N$6
  Top 0.254: R8.1 38.92,76.42 D1.A

### Text on the board
tPlace: Sensor- M0/M1/M2 | Motor- M0/M1/M2 | Sensor | GND | Motor | Motor- M3/M4/M5 | Sensor- M3/M4/M5